# Altium schematic sheet Main_Board_ESP32.SchDoc
size A; SheetNumber: 3; SheetTotal: 4
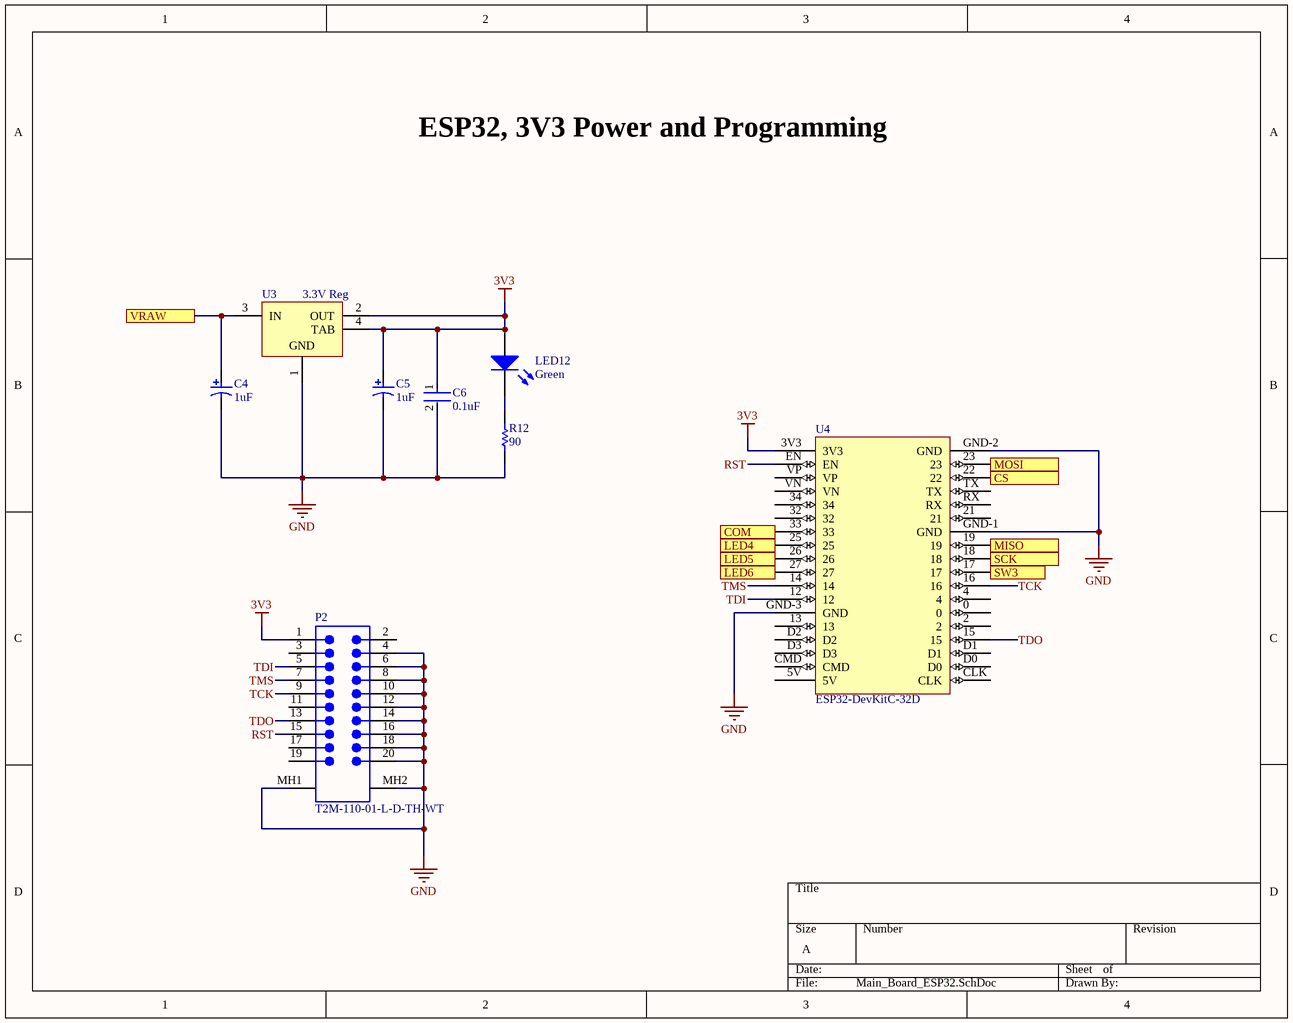
[diagram p0: Main_Board_ESP32.SchDoc]

## Parts
C4  1uF  [KEMT-T491-C_L]
C5  1uF  [KEMT-T491-C_L]
C6  0.1uF  [FP-GCM188-0_1-IPC_B]
LED12  Green  [0603_A]
P2  T2M-110-01-L-D-TH-WT  [SMTC-T2M-110-01-X-D-TH-WT]
R12  90  [RESC2013X50X40LL20T20]
U3  3.3V Reg  [KTT0003B_N]
U4  ESP32-DevKitC-32D  [ESP32-DevKitC-32D]

## Ports
COM, CS, LED4, LED5, LED6, MISO, MOSI, SCK, SW3, VRAW

## Nets
3V3: C5.1 C6.1 LED12.2(A) P2.1 U3.2(OUT) U3.4(TAB) U4.3V3
GND: C4.2 C5.2 C6.2 P2.4 P2.6 P2.8 P2.10 P2.12 P2.14 P2.16 P2.18 P2.20 P2.MH1 P2.MH2 R12.1 U3.1(GND) U4.GND-1(GND) U4.GND-2(GND) U4.GND-3(GND)
COM: U4.33 ; port COM
CS: U4.22 ; port CS
LED4: U4.25 ; port LED4
LED5: U4.26 ; port LED5
LED6: U4.27 ; port LED6
MISO: U4.19 ; port MISO
MOSI: U4.23 ; port MOSI
RST: P2.15 U4.EN
SCK: U4.18 ; port SCK
SW3: U4.17 ; port SW3
TCK: P2.9 U4.16
TDI: P2.5 U4.12
TDO: P2.13 U4.15
TMS: P2.7 U4.14
VRAW: C4.1 U3.3(IN) ; port VRAW
NetLED12_1: LED12.1(K) R12.2

Not connected (* = marked no-connect by the designer): P2 2 3 11 17 19; U4 0 2 4 5V 13 21 32 34 CLK CMD D0 D1 D2 D3 RX TX VN VP

## Notes on the sheet
- ESP32, 3V3 Power and Programming

## Library data of the parts
C4 C5 = CMP-2000-07195-1: Tantalum Capacitor, 1 uF, +/- 10%, 50 V, -55 to 125 degC, 2-Pin SMD, RoHS, Tape and Reel; Manufacturer: Kemet; Capacitance: 1000000pF; Rad Hardened: No; Case Style: Molded; Product Diameter (mm): NotRequiredmm; Seal: NotRequired; DF: 4%; ESR: 5.5ohm; DCL: 0.5uA; Product Length (mm): 6mm; Product Height (mm): 2.5mm; Polarity: Polar; Voltage: 50VDC; Product Depth (mm): 3.2mm; Operating Temp Range: -55Cto125C; Package Description: 2-Pin Surface Mount Device, Body 6 x 3.2 mm; Failure Rate: NotRequired; Seated Plane Height: NotRequiredmm; Lead Spacing (nom): NotRequiredmm; Packaging: TapeandReel; Case Code: C; Length W/Weld: NotRequiredmm; Tolerance (+ or -): 10%; Datasheet URL: http://capacitoredge.kemet.com/capedge2/DataSheet/Datasheet-T491C105K050AT.pdf?pn=T491C105K050AT; Datasheet Version: 10/2016; Manufacturer URL: http://www.kemet.com/; Wire Form: NotRequired; Package / Case: 6032-28; Mounting Technology: SurfaceMount; Construction: SMTChip; Package Reference: T491-C; Length W/Weld (max): NotRequiredmm; Insulation: NotRequired; Mounting Style: SurfaceMount
C6 = CMP-2006-02353-3: Ceramic Capacitor for Automotive 100nF  ±10% 50VDC X8L 0603 Paper T/R; Voltage Rating: 50V; Height: 0.8mm; Lead Free: Lead Free; Case/Package: 0603; Dielectric: X8L; Packaging: Tape and Reel; Termination: SMD/SMT; Package Quantity: 4000; Width: 0.5mm; Max Operating Temperature: 150°C; Case Code (Metric): 1608; Thickness: 0.035inch; Capacitance: 100nF; Tolerance: 10%; Voltage Rating (DC): 50V; Ratings: AEC-Q200; Case Code (Imperial): 0603; Voltage: 50V; Depth: 0.8mm; Radiation Hardening: No; Length: 1.6mm; Mount: Surface Mount; Min Operating Temperature: -55°C
LED12 = CMP-1426-00002-1: SMD mono-color Chip LED, WL-SMCW, Green; PartNumber: 150060GS75000; Manufacturer: Wuerth Elektronik; ComponentLink1URL: http://www.we-online.com; ComponentLink2Description: Datasheet; Color: Green; ComponentLink2URL: http://katalog.we-online.com/led/datasheet/150060GS75000.pdf; PackageReference: 0603_A; ComponentLink1Description: Manufacturer URL
P2 = CMP-1029-00094-1: High Reliability Cable Header, Through-hole, Vertical, -55 to 125 degC, 2 mm Pitch, 20-Pin, Male, RoHS; Manufacturer: Samtec; Pitch: 2 mm; ComponentLink3URL: http://www.samtec.com/documents/webfiles/cpdf/T2M-1XX-XX-X-D-XX-XX-MKT.pdf; Mounting Technology: Through-hole; Orientation: Vertical; ComponentLink2URL: http://d2a072wq521u33.cloudfront.net/catalog_english//t2m.pdf; ComponentLink1URL: http://www.samtec.com; ComponentLink2Description: Datasheet; PackageReference: T2M-110-01-X-D-TH-WT; ComponentLink1Description: Manufacturer URL; RoHS: True; ComponentLink3Description: Package Specification; PartNumber: T2M-110-01-L-D-TH-WT; PackageDescription: 2mm Shrouded Terminal Strip; PackageVersion: V, 3/2009; Temperature Range: -55 to 125 degC; DatasheetVersion: F-214
R12 = CMP-2001-03378-1: Manufacturer: Susumu; Part Number: RR1220P-331-D
U3 = CMP-0062-00678-5: 800mA Low-Dropout Linear Regulator, 3-pin TO-263, Pb-Free; PartNumber: LM1117SX-3.3/NOPB; Manufacturer: Texas Instruments; CompType: LDO IC; PowerWise: N; PackageTopMarking: NSUZXYTTE#*LM1117S*3.3; High-Reliability: Y; RoHS: Y; ComponentLink1URL: http://www.ti.com/general/docs/lit/getliterature.tsp?genericPartNumber=LM1117&fileType=pdf; PackageDescription: TO-263, Molded, .400 x .390 x .180in, 3 Lead, .1in Pitch, Surface Mount; PackageReference: KTT0003B; Code_JEDEC: MO-169-AA; PinCount: 3; ComponentLink1Description: Datasheet URL